# Altium schematic sheet PCB_INTER.SchDoc
size A3; SheetNumber: 1; SheetTotal: 1
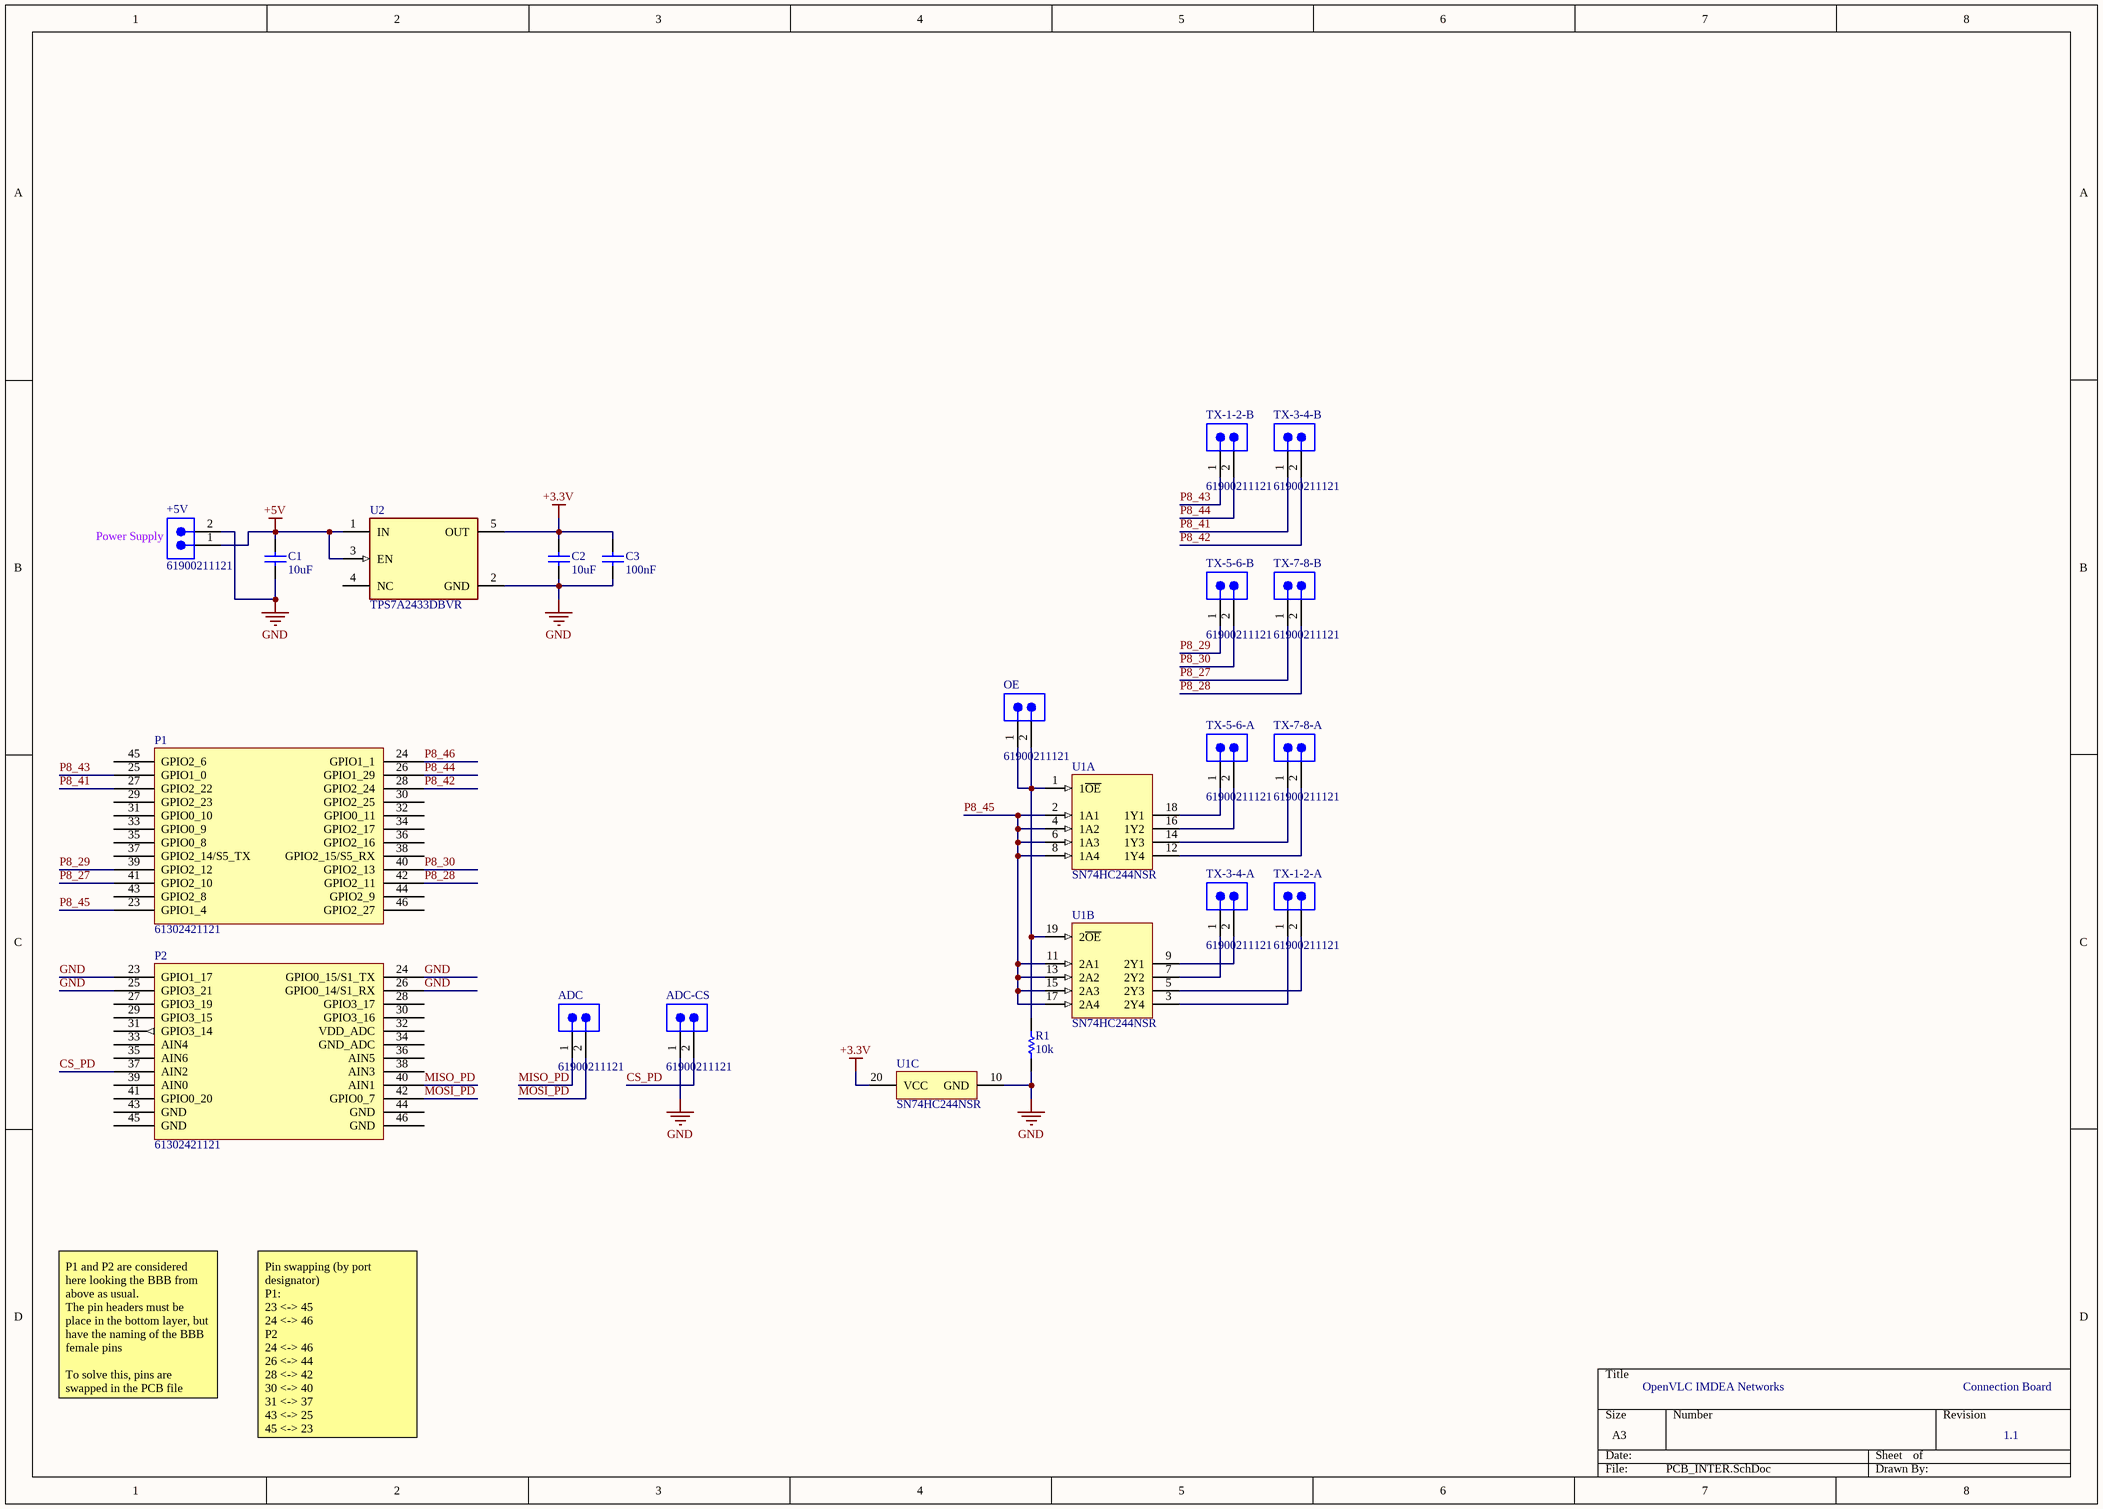
[diagram p0: PCB_INTER.SchDoc]

## Parts
+5V  61900211121  [61900211121]
ADC  61900211121  [61900211121]
ADC-CS  61900211121  [61900211121]
C1  value 10uF  [RESC1608X55N]  (hidden comment: GRM188R6YA106MA73D)
C2  value 10uF  [RESC1608X55N]  (hidden comment: GRM188R6YA106MA73D)
C3  value 100nF  [RESC1608X55N]  (hidden comment: GCM188R71H104KA57J)
OE  61900211121  [61900211121]
P1  61302421121  [BBB_CAPE_NO_HEADER_R_24]
P2  61302421121  [BBB_CAPE_NO_HEADER_R_24]
R1  value 10k  [RESC1608X55N]  (hidden comment: RT0603BRD0710KL)
TX-1-2-A  61900211121  [61900211121]
TX-1-2-B  61900211121  [61900211121]
TX-3-4-A  61900211121  [61900211121]
TX-3-4-B  61900211121  [61900211121]
TX-5-6-A  61900211121  [61900211121]
TX-5-6-B  61900211121  [61900211121]
TX-7-8-A  61900211121  [61900211121]
TX-7-8-B  61900211121  [61900211121]
U1  SN74HC244NSR  [NS0020A_L]  (parts A,B,C of 3)
U2  TPS7A2433DBVR  [FP-DBV0005A-MFG]

## Nets
+3.3V: C2.2 C3.1 U1.20(VCC) U2.5(OUT)
+5V: +5V.1 C1.1 U2.1(IN) U2.3(EN)
GND: +5V.2 ADC-CS.1 C1.2 C2.1 C3.2 P2.23(GPIO1_17) P2.24(GPIO0_15/S1_TX) P2.25(GPIO3_21) P2.26(GPIO0_14/S1_RX) R1.2 U1.10(GND) U2.2(GND)
CS_PD: ADC-CS.2 P2.37(AIN2)
MISO_PD: ADC.1 P2.40(AIN1)
MOSI_PD: ADC.2 P2.42(GPIO0_7)
P8_27: P1.41(GPIO2_10) TX-7-8-B.1
P8_28: P1.42(GPIO2_11) TX-7-8-B.2
P8_29: P1.39(GPIO2_12) TX-5-6-B.1
P8_30: P1.40(GPIO2_13) TX-5-6-B.2
P8_41: P1.27(GPIO2_22) TX-3-4-B.1
P8_42: P1.28(GPIO2_24) TX-3-4-B.2
P8_43: P1.25(GPIO1_0) TX-1-2-B.1
P8_44: P1.26(GPIO1_29) TX-1-2-B.2
P8_45: P1.23(GPIO1_4) U1.2(1A1) U1.4(1A2) U1.6(1A3) U1.8(1A4) U1.11(2A1) U1.13(2A2) U1.15(2A3) U1.17(2A4)
P8_46: P1.24(GPIO1_1)
NetOE_1: OE.1 OE.2 R1.1 U1.1(1~{OE}) U1.19(2~{OE})
NetTX-1-2-A_1: TX-1-2-A.1 U1.3(2Y4)
NetTX-1-2-A_2: TX-1-2-A.2 U1.5(2Y3)
NetTX-3-4-A_1: TX-3-4-A.1 U1.7(2Y2)
NetTX-3-4-A_2: TX-3-4-A.2 U1.9(2Y1)
NetTX-5-6-A_1: TX-5-6-A.1 U1.18(1Y1)
NetTX-5-6-A_2: TX-5-6-A.2 U1.16(1Y2)
NetTX-7-8-A_1: TX-7-8-A.1 U1.14(1Y3)
NetTX-7-8-A_2: TX-7-8-A.2 U1.12(1Y4)

Not connected (* = marked no-connect by the designer): P1 29(GPIO2_23) 30(GPIO2_25) 31(GPIO0_10) 32(GPIO0_11) 33(GPIO0_9) 34(GPIO2_17) 35(GPIO0_8) 36(GPIO2_16) 37(GPIO2_14/S5_TX) 38(GPIO2_15/S5_RX) 43(GPIO2_8) 44(GPIO2_9) 45(GPIO2_6) 46(GPIO2_27); P2 27(GPIO3_19) 28(GPIO3_17) 29(GPIO3_15) 30(GPIO3_16) 31(GPIO3_14) 32(VDD_ADC) 33(AIN4) 34(GND_ADC) 35(AIN6) 36(AIN5) 38(AIN3) 39(AIN0) 41(GPIO0_20) 43(GND) 44(GND) 45(GND) 46(GND); U2 4(NC)

## Notes on the sheet
- (near +5V) Power Supply
- P1 and P2 are considered here looking the BBB from above as usual.
  The pin headers must be place in the bottom layer, but have the naming of the BBB female pins
  To solve this, pins are swapped in the PCB file
- OpenVLC IMDEA Networks
- Connection Board
- Pin swapping (by port designator)
  P1:
  23 <-> 45
  24 <-> 46
  P2
  24 <-> 46
  26 <-> 44
  28 <-> 42
  30 <-> 40
  31 <-> 37
  43 <-> 25
  45 <-> 23
- 1.1

## Library data of the parts
+5V ADC ADC-CS OE TX-1-2-A TX-1-2-B TX-3-4-A TX-3-4-B TX-5-6-A TX-5-6-B TX-7-8-A TX-7-8-B = CMP-1502-00584-3: NexarPartId: 18818218; Gender: Male; Connector Type: Male Pin; Insulation Resistance: 1GΩ; Contact Resistance: 20mΩ; Number of Contacts: 2; Operating Supply Voltage: 250V; Current Rating: 3A; Pitch: 2.54mm; Color: Beige; Fastening Type: Friction; Number of Pins: 2; Lead Pitch: 2.54mm; Orientation: Vertical; Max Operating Temperature: 105°C; Contact Mating Length: 7.493mm; RoHS: Compliant; Voltage Rating: 250V; Number of Positions: 2; Mount: Through Hole; Length: 5.08mm; Contact Plating: Tin; Width: 5.12mm; Termination: Through Hole; Flammability Rating: UL94 V-0; Min Operating Temperature: -40°C; Housing Material: Nylon; Contact Gender: Male; Number of Rows: 1; Packaging: Bulk; REACH SVHC: Unknown; Contact Material: Copper; Height: 11.75mm
C1-C3 = Cap: Capacitor; Published: 8-Jun-2000; LatestRevisionDate: 17-Jul-2002; LatestRevisionNote: Re-released for DXP Platform.; PackageReference: RAD-0.3; Publisher: Altium Limited; PackageDescription: Radial Cap, Thru-Hole; 2 Leads; 0.3 in Pin Spacing
P1 = BBB_P8_reduced
P2 = BBB_P9_reduced
R1 = Res1: Resistor; Published: 8-Jun-2000; LatestRevisionDate: 17-Jul-2002; LatestRevisionNote: Re-released for DXP Platform.; PackageReference: AXIAL-0.3; Publisher: Altium Limited; PackageDescription: Axial Device, Thru-Hole; 2 Leads; 0.3 in Pin Spacing
U1 = CMP-0440-01058-3: Octal Buffers And Line Drivers With 3-State Outputs, NS0020A, LARGE T&R; Manufacturer: Texas Instruments; Input Type: CMOS; VCC(Min)(V): 2; Bits(#): 8; Voltage(Nom)(V): 6; F @ Nom Voltage(Max)(Mhz): 28; tpd @ Nom Voltage(Max)(ns): 29; Rating: Catalog; ICC @ Nom Voltage(Max)(mA): 0.08; DatasheetVersion: SCLS130D; Generic Part Number: SN74HC244; PackageReference: NS0020A; PackageVersion: http://www.ti.com/lit/ml/msop002a/msop002a.pdf; VCC(Max)(V): 6; Output Type: CMOS; Operating Temperature Range(C): -40 to 85
U2 = CMP-00370-106221451-1: TPS7A2433DBVR 200-mA, 18-V, ultra-low-IQ, low-dropout (LDO) voltage regulator with enable ; 5-SOT-23 -40 to 125; Manufacturer Lifecycle Status: ACTIVE; Number of Channels: 1; Output Voltage: 3.3V; Number of Pins: 5; NexarPartId: 106221451; Lifecycle Status: Production; Thickness: 1.2mm; Length: 2.9mm; Height: 1.45mm; Case/Package: SOT-23; Width: 1.6mm